# Altium project PCB_Project_Mach_DK_Relay_3_Kenh.PrjPcb
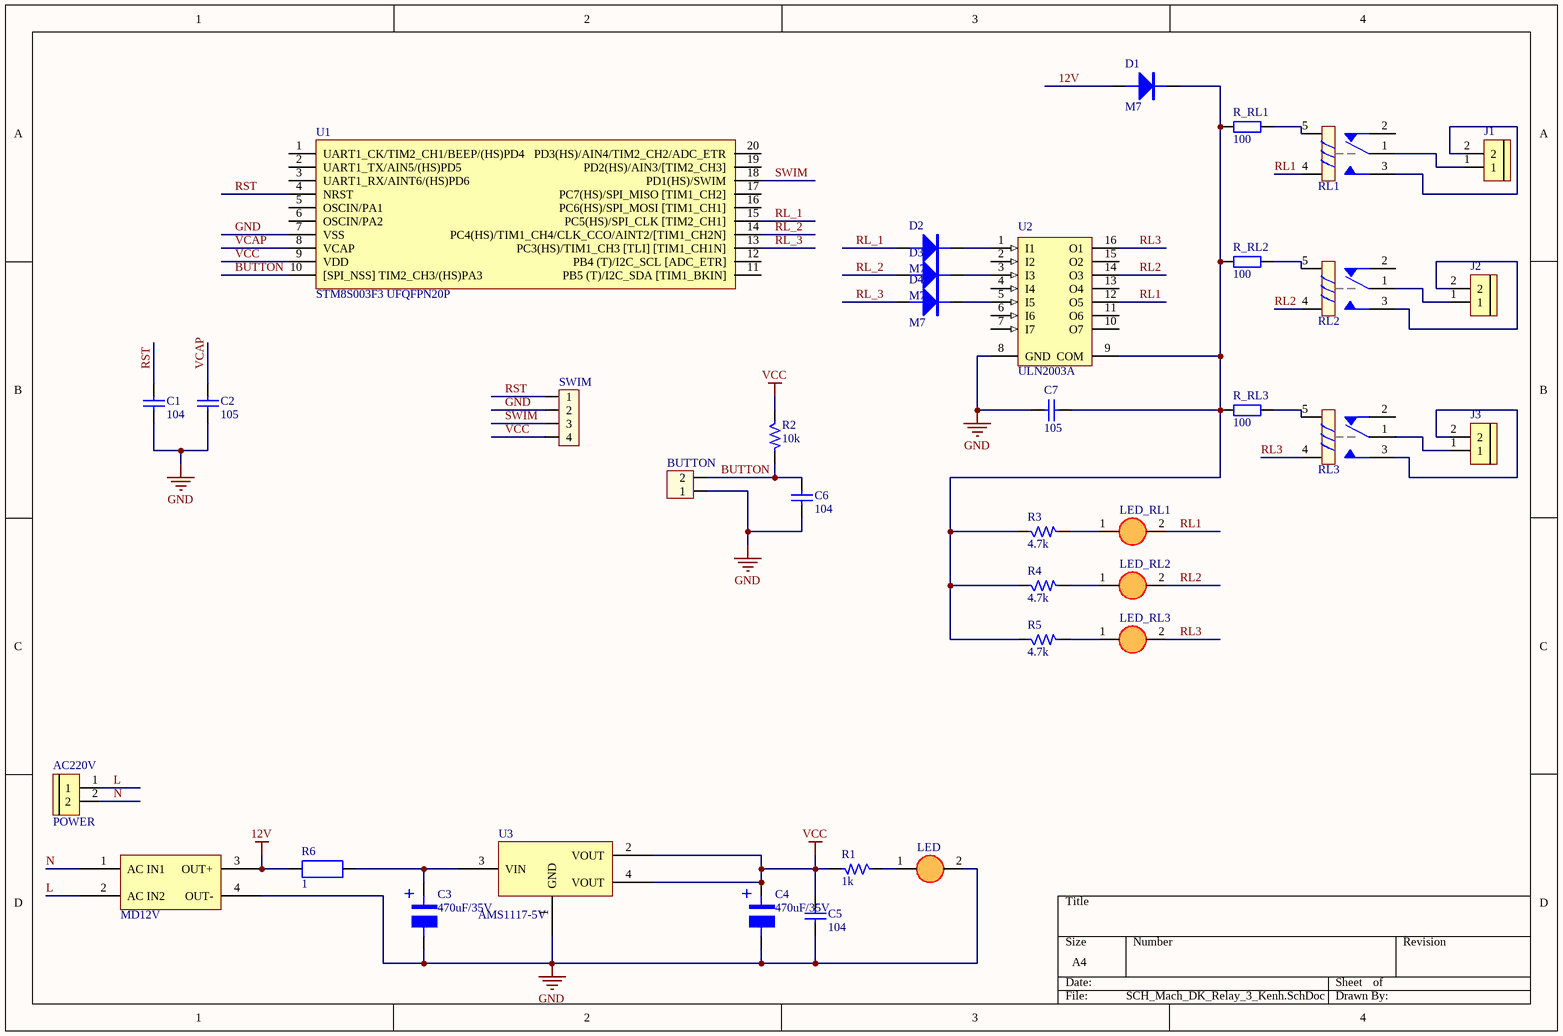
[diagram p0: SCH_Mach_DK_Relay_3_Kenh.SchDoc]
1 sheet, 37 parts. Net scope: global (net labels, ports and power ports of the same name join across sheets).
Board file: PCB_Mach_DK_Relay_3_Kenh.PcbDoc

## Sheet SCH_Mach_DK_Relay_3_Kenh.SchDoc
size A4

### Parts
AC220V  POWER  [BIG_Header 2]
BUTTON  Header 2  [Header 2 Duc Cong 2.54]  (value not drawn)
C1  104  [Tu 0805]
C2  105  [Tu 0805]
C3  470uF/35V  [Tu Hoa 450uF - 16V]
C4  470uF/35V  [Tu Hoa 450uF - 16V]
C5  104  [Tu 0805]
C6  104  [Tu 0805]
C7  105  [Tu 0805]
D1  M7  [SMB]
D2  M7  [SMB]
D3  M7  [SMB]
D4  M7  [SMB]
J1  Header 2  [BIG_Header 2]  (value not drawn)
J2  Header 2  [BIG_Header 2]  (value not drawn)
J3  Header 2  [BIG_Header 2]  (value not drawn)
LED  LED3  [LED RED 5mm]  (value not drawn)
LED_RL1  LED3  [LED RED 5mm]  (value not drawn)
LED_RL2  LED3  [LED RED 5mm]  (value not drawn)
LED_RL3  LED3  [LED RED 5mm]  (value not drawn)
MD12V  Module Driver LED 1x3W  [Module Driver LED]  (value not drawn)
R1  1k  [Tro SMD 0805]
R2  10k  [Tro SMD 0805]
R3  4.7k  [Tro SMD 0805]
R4  4.7k  [Tro SMD 0805]
R5  4.7k  [Tro SMD 0805]
R6  1  [R2W]
R_RL1  100  [1206 SMD]
R_RL2  100  [1206 SMD]
R_RL3  100  [1206 SMD]
RL1  Relay ?V - 10A  [RELAY5PIN-10A]  (value not drawn)
RL2  Relay ?V - 10A  [RELAY5PIN-10A]  (value not drawn)
RL3  Relay ?V - 10A  [RELAY5PIN-10A]  (value not drawn)
SWIM  JP4  [JP4]  (value not drawn)
U1  STM8S003F3 UFQFPN20P  [TSSOP20]
U2  ULN2003A  [SOP16]
U3  AMS1117-5V  [SOT223-4N]

### Nets
12V: D1.1 MD12V.3(OUT+) R6.1
GND: BUTTON.1 C1.1 C2.1 C3.2 C4.2 C5.1 C6.1 C7.2 LED.2(K) MD12V.4(OUT-) SWIM.2 U1.7(VSS) U2.8(GND) U3.1(GND)
VCC: C4.1 C5.2 R1.2 R2.1 SWIM.4 U1.9(VDD) U3.2(VOUT) U3.4(VOUT)
BUTTON: BUTTON.2 C6.2 R2.2 U1.10([SPI_NSS]_TIM2_CH3/(HS)PA3)
L: AC220V.1 MD12V.2(AC_IN2)
N: AC220V.2 MD12V.1(AC_IN1)
RL1: LED_RL1.2(K) RL1.4 U2.12(O5)
RL2: LED_RL2.2(K) RL2.4 U2.14(O3)
RL3: LED_RL3.2(K) RL3.4 U2.16(O1)
RL_1: D2.1 U1.15(PC5(HS)/SPI_CLK_[TIM2_CH1])
RL_2: D3.1 U1.14(PC4(HS)/TIM1_CH4/CLK_CCO/AINT2/[TIM1_CH2N])
RL_3: D4.1 U1.13(PC3(HS)/TIM1_CH3_[TLI]_[TIM1_CH1N])
RST: C1.2 SWIM.1 U1.4(NRST)
SWIM: SWIM.3 U1.18(PD1(HS)/SWIM)
VCAP: C2.2 U1.8(VCAP)
NetC3_1: C3.1 R6.2 U3.3(VIN)
NetC7_1: C7.1 D1.2 R3.1 R4.1 R5.1 R_RL1.1 R_RL2.1 R_RL3.1 U2.9(COM)
NetD2_2: D2.2 U2.1(I1)
NetD3_2: D3.2 U2.3(I3)
NetD4_2: D4.2 U2.5(I5)
NetJ1_1: J1.1 RL1.1
NetJ1_2: J1.2 RL1.3
NetJ2_1: J2.1 RL2.1
NetJ2_2: J2.2 RL2.3
NetJ3_1: J3.1 RL3.1
NetJ3_2: J3.2 RL3.3
NetLED_1: LED.1(A) R1.1
NetLED_RL1_1: LED_RL1.1(A) R3.2
NetLED_RL2_1: LED_RL2.1(A) R4.2
NetLED_RL3_1: LED_RL3.1(A) R5.2
NetR_RL1_2: R_RL1.2 RL1.5
NetR_RL2_2: R_RL2.2 RL2.5
NetR_RL3_2: R_RL3.2 RL3.5

Not connected (* = marked no-connect by the designer): RL1 2; RL2 2; RL3 2; U1 1(UART1_CK/TIM2_CH1/BEEP/(HS)PD4) 2(UART1_TX/AIN5/(HS)PD5) 3(UART1_RX/AINT6/(HS)PD6) 5(OSCIN/PA1) 6(OSCIN/PA2) 11(PB5_(T)/I2C_SDA_[TIM1_BKIN]) 12(PB4_(T)/I2C_SCL_[ADC_ETR]) 16(PC6(HS)/SPI_MOSI_[TIM1_CH1]) 17(PC7(HS)/SPI_MISO_[TIM1_CH2]) 19(PD2(HS)/AIN3/[TIM2_CH3]) 20(PD3(HS)/AIN4/TIM2_CH2/ADC_ETR); U2 2(I2) 4(I4) 6(I6) 7(I7) 10(O7) 11(O6) 13(O4) 15(O2)

### Notes on the sheet
- (in symbol Cap100uF 50V) +

### Library data of the parts
AC220V J1-J3 = Header 2: Big Header 2
BUTTON = Hed2: Header 2 (Green); Value: Header 2
C1 C2 C5-C7 = CAP 0805
C3 C4 = Cap100uF 50V: 220uF: 220uF
D1-D4 = DIODE
LED LED_RL1-LED_RL3 = LED 3mm
MD12V = Module DK LED 1X3w
R1-R5 = Res: Resistor 1/4W; Value: R1/4W - 1K
R6 = R2W: Resistor 2W; Value: R2W - 47
R_RL1-R_RL3 = R1/4W: Resistor 1/4W; Value: R1/4W - 1K
RL1-RL3 = Relay 10A: Relay SPDT,10A - 12VDC 5 Pin
U2 = ULN2003A: High-Voltage, High-Current Darlington Array; LatestRevisionNote: Stylized 3D Model Added.; Publisher: Altium Limited; Value: ULN2003A
U3 = AMS1117: AMS